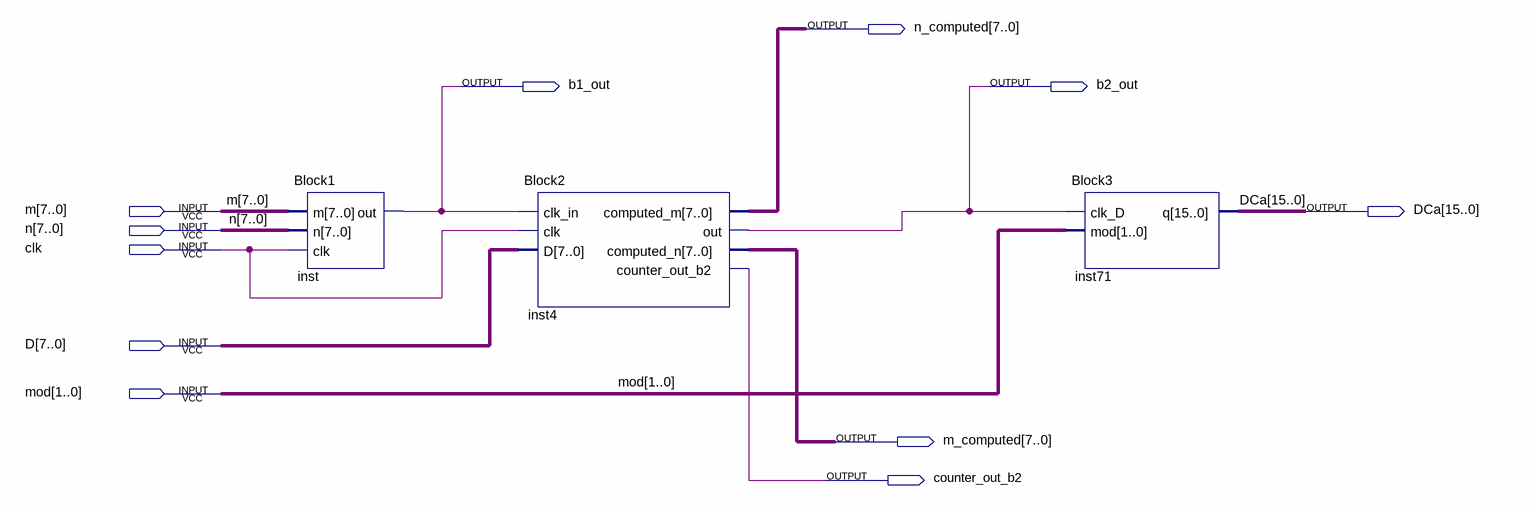
[diagram p0: schematic sheet]
// Quartus schematic CombinedBlocks.bdf as structural Verilog: 3 symbols, 11 pins
module CombinedBlocks (
  input  [7:0] m,
  input  [7:0] n,
  input  clk,
  input  [7:0] D,
  input  [1:0] mod,
  output [7:0] n_computed,
  output b1_out,
  output b2_out,
  output [15:0] DCa,
  output [7:0] m_computed,
  output counter_out_b2
);

  Block1 inst (.m(m), .n(n), .clk(clk), .out(b1_out));
  Block2 inst4 (
    .clk_in(b1_out), .clk(clk), .D(D), .computed_m(n_computed), .out(b2_out), .computed_n(m_computed),
    .counter_out_b2(counter_out_b2));
  Block3 inst71 (.clk_D(b2_out), .mod(mod), .q(DCa));
endmodule
